# EasyEDA Pro project 2025_08_20_fpga.epro

# Board PCB1
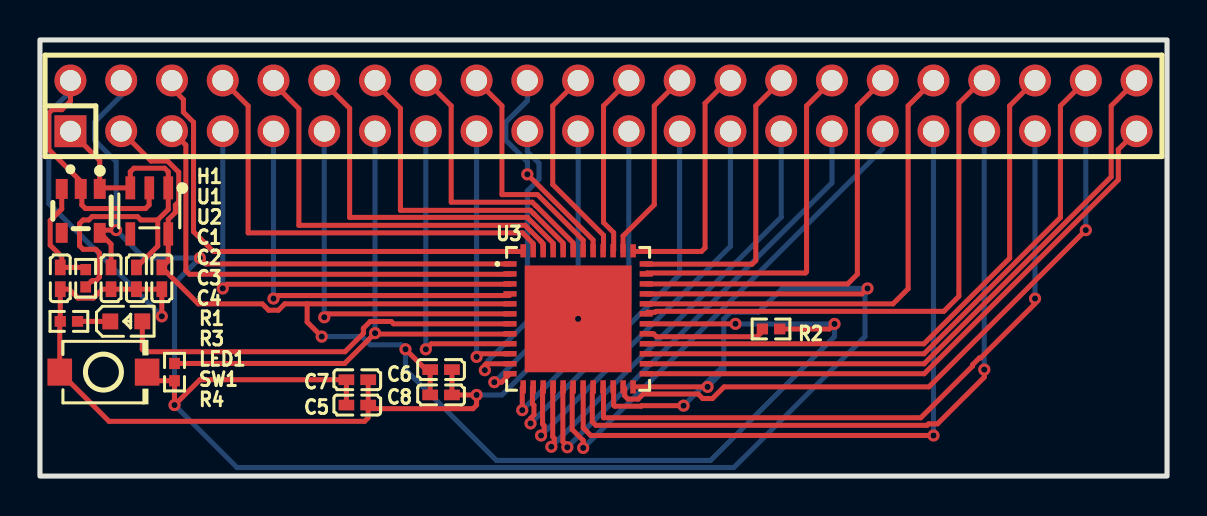
[diagram p0: board, top side]
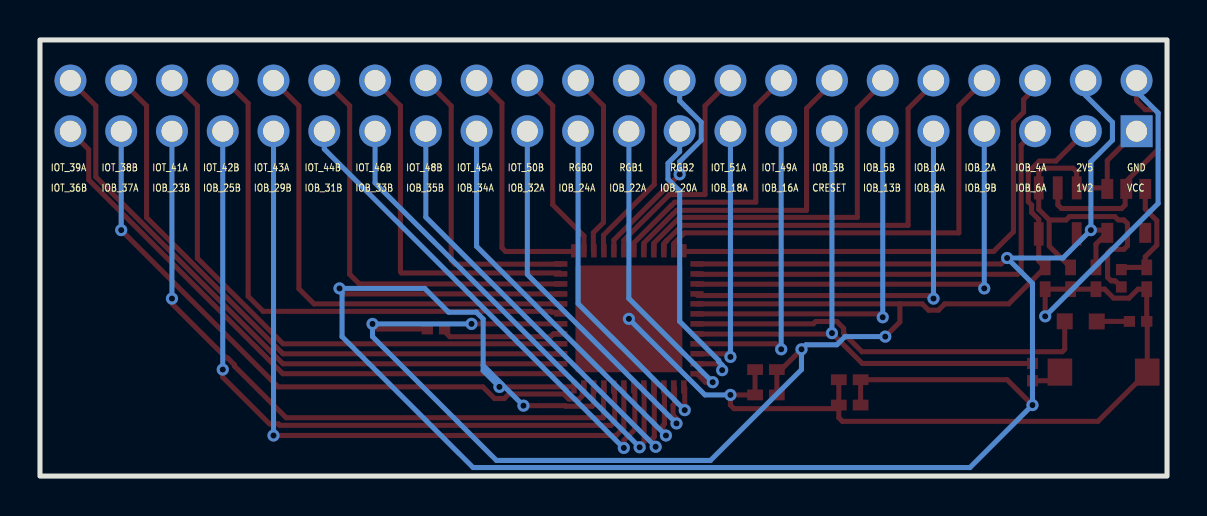
[diagram p1: board, bottom side, seen from below]

Outline 56.39 x 21.84 mm; copper layers: Top Layer, Bottom Layer. Coordinates in mm from the lower left corner of the outline.
Outline path: rectangle 0,21.84 56.39,0
Stack: Top Layer 0.035mm / Dielectric1 1.51mm FR4 er 4.5 / Bottom Layer 0.035mm

## Design rules (mm)
template: JLCPCB Capability(Two Layers Board)
spacing copperThickness1oz (default): track to track 0.102, other pairs 0.152 to 0.3
spacing copperThickness2oz: track to track 0.203, other pairs 0.152 to 0.3
track width copperThickness1oz (default): min 0.127, default 0.254, max 2.54
track width copperThickness2oz: min 0.203, default 0.254, max 2.54
differential pair differentialPair (default): width min 0.127, default 0.254, max 2.54; gap min 0.152, default 0.152
via viaSize (default): diameter min 0.5, default 0.61, max 10; hole min 0.3, default 0.305, max 6.3

## Placement (name value [footprint] x y rotation side)
C1  10uF  [C0402]  4.83 9.91 90 top
C2  1uF  [C0402]  1.02 9.91 90 top
C3  10uF  [C0402]  3.56 9.91 90 top
C4  10uF  [C0402]  6.1 9.91 90 top
C5  10uF  [C0402]  15.88 3.56 180 top
C6  10uF  [C0402]  20.07 5.33 180 top
C7  100nF  [C0402]  15.88 4.83 180 top
C8  100nF  [C0402]  20.07 4.06 180 top
H1  X6521WV-2x22H-C60D30  [HDR-TH_44P-2.54-V-M-R2-C22-S2.54]  28.19 18.54 0 top
LED1  XL-1608UBC-04  [LED0603-RD_BLUE]  4.32 7.75 0 top
R1  10kΩ  [R0402]  2.29 9.91 270 top
R2  100Ω  [R0402]  36.58 7.37 180 top
R3  100Ω  [R0402]  1.45 7.75 0 top
R4  10kΩ  [R0402]  6.73 5.21 90 top
SW1  TS-1088-AR02016  [SW-SMD_L3.9-W3.0-P4.45]  3.17 5.21 0 top
U1  TLV70225DBVR  [SOT-23-5_L2.9-W1.6-P0.95-LS2.8-BR]  2.04 13.28 90 top
U2  TLV70212DBVR  [SOT-23-5_L3.0-W1.7-P0.95-LS2.8-BL]  5.47 13.28 180 top
U3  ICE40UP5K-SG48I  [QFN-48_L7.0-W7.0-P0.50-TL-EP5.4-1]  26.92 7.87 0 top

## Footprints (pads in the part's own frame, mm; a bottom-side part is the same pattern mirrored in y, then rotated)
C0402
  rect 0.79x0.54 smd: 1(-0.545,0) 2(0.545,0)
HDR-TH_44P-2.54-V-M-R2-C22-S2.54
  rect 1.6x1.6 hole 1.05: 1(-26.67,-1.27)
  round 1.6 hole 1.05: 2(-26.67,1.27) 3(-24.13,-1.27) 4(-24.13,1.27) 5(-21.59,-1.27) 6(-21.59,1.27) 7(-19.05,-1.27) 8(-19.05,1.27) 9(-16.51,-1.27) 10(-16.51,1.27) 11(-13.97,-1.27) 12(-13.97,1.27) 13(-11.43,-1.27) 14(-11.43,1.27) 15(-8.89,-1.27) 16(-8.89,1.27) 17(-6.35,-1.27) 18(-6.35,1.27) 19(-3.81,-1.27) 20(-3.81,1.27) 21(-1.27,-1.27) 22(-1.27,1.27) 23(1.27,-1.27) 24(1.27,1.27) 25(3.81,-1.27) 26(3.81,1.27) 27(6.35,-1.27) 28(6.35,1.27) 29(8.89,-1.27) 30(8.89,1.27) 31(11.43,-1.27) 32(11.43,1.27) 33(13.97,-1.27) 34(13.97,1.27) 35(16.51,-1.27) 36(16.51,1.27) 37(19.05,-1.27) 38(19.05,1.27) 39(21.59,-1.27) 40(21.59,1.27) 41(24.13,-1.27) 42(24.13,1.27) 43(26.67,-1.27) 44(26.67,1.27)
LED0603-RD_BLUE
  rect 0.8x0.8 smd: 1(-0.799,-0.004) 2(0.799,0.004)
QFN-48_L7.0-W7.0-P0.50-TL-EP5.4-1
  rect 0.665x0.28 smd: 1(-3.408,2.75) 2(-3.408,2.25) 3(-3.408,1.75) 4(-3.408,1.25) 5(-3.408,0.75) 6(-3.408,0.25) 7(-3.408,-0.25) 8(-3.408,-0.75) 9(-3.408,-1.25) 10(-3.408,-1.75) 11(-3.408,-2.25) 12(-3.408,-2.75) 25(3.408,-2.75) 26(3.408,-2.25) 27(3.408,-1.75) 28(3.408,-1.25) 29(3.408,-0.75) 30(3.408,-0.25) 31(3.408,0.25) 32(3.408,0.75) 33(3.408,1.25) 34(3.408,1.75) 35(3.408,2.25) 36(3.408,2.75)
  rect 0.28x0.665 smd: 13(-2.75,-3.408) 14(-2.25,-3.408) 15(-1.75,-3.408) 16(-1.25,-3.408) 17(-0.75,-3.408) 18(-0.25,-3.408) 19(0.25,-3.408) 20(0.75,-3.408) 21(1.25,-3.408) 22(1.75,-3.408) 23(2.25,-3.408) 24(2.75,-3.408) 37(2.75,3.408) 38(2.25,3.408) 39(1.75,3.408) 40(1.25,3.408) 41(0.75,3.408) 42(0.25,3.408) 43(-0.25,3.408) 44(-0.75,3.408) 45(-1.25,3.408) 46(-1.75,3.408) 47(-2.25,3.408) 48(-2.75,3.408)
  rect 5.35x5.35 smd: 49(0,0)
R0402
  rect 0.566x0.54 smd: 1(-0.433,0) 2(0.433,0)
SOT-23-5_L2.9-W1.6-P0.95-LS2.8-BR
  rect 1x0.6 smd: 1(1.1,-0.95) 2(1.1,0) 3(1.1,0.95) 4(-1.1,0.95) 5(-1.1,-0.95)
SOT-23-5_L3.0-W1.7-P0.95-LS2.8-BL
  rect 0.49x1.157 smd: 1(-0.95,-1.153) 2(0,-1.153) 3(0.95,-1.153)
  rect 0.49x1.175 smd: 4(0.95,1.153) 5(-0.95,1.153)
SW-SMD_L3.9-W3.0-P4.45
  rect 1.23x1.36 smd: 1(-2.185,0) 2(2.185,0)

## Nets
1V2: C4.2 C6.2 C8.2 H1.3 R2.1 U2.5 U3.5 U3.30
2V5: C3.2 C5.2 C7.2 H1.4 R4.1 SW1.2 U1.5 U3.1 U3.22 U3.24 U3.33
GND: C1.1 C2.1 C3.1 C4.1 C5.1 C6.1 C7.1 C8.1 H1.2 R3.1 SW1.1 U1.2 U2.2 U3.49
VCC: C1.2 H1.1 R1.2 U1.1 U2.1 U2.3
VCCPLL: R2.2 U3.29
CDONE: LED1.2 U3.7
CRESET: H1.13 R4.2 U3.8
IOB_0A: H1.10 U3.46
IOB_2A: H1.8 U3.47
IOB_3B: H1.14 U3.44
IOB_4A: H1.6 U3.48
IOB_5B: H1.12 U3.45
IOB_6A: H1.5 U3.2
IOB_8A: H1.9 U3.4
IOB_9B: H1.7 U3.3
IOB_13B: H1.11 U3.6
IOB_16A: H1.15 U3.9
IOB_18A: H1.17 U3.10
IOB_20A: H1.19 U3.11
IOB_22A: H1.21 U3.12
IOB_23B: H1.39 U3.21
IOB_24A: H1.23 U3.13
IOB_25B: H1.37 U3.20
IOB_29B: H1.35 U3.19
IOB_31B: H1.33 U3.18
IOB_32A: H1.25 U3.14
IOB_33B: H1.31 U3.17
IOB_34A: H1.27 U3.15
IOB_35B: H1.29 U3.16
IOB_37A: H1.41 U3.23
IOT_36B: H1.43 U3.25
IOT_38B: H1.42 U3.27
IOT_39A: H1.44 U3.26
IOT_41A: H1.40 U3.28
IOT_42B: H1.38 U3.31
IOT_43A: H1.36 U3.32
IOT_44B: H1.34 U3.34
IOT_45A: H1.28 U3.37
IOT_46B: H1.32 U3.35
IOT_48B: H1.30 U3.36
IOT_49A: H1.16 U3.43
IOT_50B: H1.26 U3.38
IOT_51A: H1.18 U3.42
RGB0: H1.24 U3.39
RGB1: H1.22 U3.40
RGB2: H1.20 U3.41
$1N2833: C2.2 R1.1 U1.3
$1N2896: LED1.1 R3.2

Pads without a net: U1 4; U2 4

## Via types
v1: diameter 0.61, hole 0.305, Top Layer to Bottom Layer, 32 vias

## Routing (per net, layer and track width the routed paths; a pad name or vN(x,y) marks a point on that pad's centre or on a via; arc(x,y) is an arc through that point)
1V2: length 76.4
  Top Layer w0.254: U3.30 v1(34.8,7.62) ; H1.3 5.56,15.78 6.39,15.78 6.94,15.22 6.94,13.74 6.77,13.57 6.77,13.21 6.42,12.85 U2.5 6.42,10.77 C4.2 7.92,8.62 11.12,8.62 11.44,8.31 11.93,8.31 12.24,8.62 13.37,8.62 ; 13.37,8.62 13.37,7.72 v1(14.1,6.98) ; 13.37,8.62 U3.5 ; v1(18.29,6.35) 19.3,5.33 19.52,5.33 19.52,4.06 ; R2.1 39.5,7.37 v1(39.75,7.62)
  Bottom Layer w0.254: v1(14.1,6.98) 16.11,6.98 16.52,6.58 18.06,6.58 v1(18.29,6.35) 18.29,5.33 22.84,0.78 33.55,0.78 39.75,6.98 v1(39.75,7.62) 34.8,7.62 v1(34.8,7.62)
2V5: length 127.6
  Top Layer w0.254: U3.33 41.13,9.12 v1(41.4,9.4) ; C3.2 3.56,11.61 U1.5 3.13,12.32 v1(3.81,12.32) ; v1(8,10.92) 8.3,10.62 U3.1 ; U3.22 28.7,4.44 28.7,3.56 28.76,3.5 30.08,3.5 30.1,3.53 v1(32.2,3.53) ; v1(33.4,4.47) U3.24 ; SW1.2 5.79,4.77 R4.1 v1(6.73,3.56) 8,4.83 C7.2 C5.2
  Bottom Layer w0.254: v1(32.2,3.53) 34.21,5.54 ; 34.21,5.54 34.21,7.87 34.56,8.21 35.95,8.21 37.14,9.4 v1(41.4,9.4) 41.4,9.27 41.28,9.14 41.28,6.98 34.72,0.43 9.86,0.43 v1(6.73,3.56) 6.73,9.65 v1(8,10.92) 5.21,10.92 v1(3.81,12.32) 3.81,15.75 2.73,16.83 2.73,17.72 4.06,19.05 H1.4 ; 34.21,5.54 34.21,5.28 v1(33.4,4.47)
GND: length 71.3
  Top Layer w0.254: 5.47,14.44 5.46,14.43 5.46,13.58 5.28,13.4 2.28,13.4 2.1,13.58 2.1,14.33 U1.2 2.04,14.76 0.44,16.36 0.44,18.19 0.61,18.35 1.09,18.35 1.52,18.78 H1.2 ; C5.1 16.6,3.38 21.66,3.38 21.84,3.56 v1(21.84,4.06) C8.1 C6.1 ; C5.1 16.42,2.92 16.24,2.74 3.46,2.74 SW1.1 0.99,7.72 1.02,7.75 C2.1 1.45,9.36 1.9,8.91 2.67,8.91 3.12,9.36 C3.1 C1.1 C4.1 v1(6.1,8) ; C5.1 C7.1
  Bottom Layer w0.254: v1(26.92,7.87) 23.11,4.06 v1(21.84,4.06) ; v1(6.1,8) 0.44,13.65 0.44,18.19 1.52,19.27 H1.2
VCC: length 21.8
  Top Layer w0.254: R1.2 2.59,9.78 2.67,9.78 2.67,9.78 2.79,9.78 2.97,9.96 2.97,11.18 2.79,11.36 2.16,11.36 1.98,11.53 1.98,12.65 2.16,12.83 2.44,12.83 2.61,12.99 4.88,12.99 5.05,12.83 5.89,12.83 5.89,12.83 ; 5.89,12.83 5.89,11.52 C1.2 ; 5.89,12.83 6.42,13.36 6.42,15.24 6.24,15.42 4.7,15.42 4.52,15.24 4.52,14.44 ; 4.52,14.44 3.04,14.44 2.99,14.38 2.99,15.81 H1.1
VCCPLL: length 6.1
  Top Layer w0.254: U3.29 30.7,7.12 30.84,6.98 35.88,6.98 36.14,7.24 R2.2
CDONE: length 20.7
  Top Layer w0.254: U3.7 17.69,7.62 17.57,7.74 16.52,7.74 16.18,7.4 16.18,7.15 15.26,6.23 5.24,6.23 5.12,6.35 LED1.2
CRESET: length 27.6
  Top Layer w0.254: U3.8 23.5,7.11 16.81,7.11 v1(16.76,7.16) 15.25,5.64 R4.2
  Bottom Layer w0.254: H1.13 v1(16.76,7.16)
IOB_0A: length 20.7
  Top Layer w0.254: U3.46 25.17,11.64 25.09,11.72 25.09,11.73 25.03,11.79 25.03,11.8 24.27,12.56 12.95,12.56 12.95,18.4 11.68,19.67 H1.10
IOB_2A: length 23
  Top Layer w0.254: H1.8 10.41,18.54 10.41,12.18 24.14,12.18 24.67,11.65 U3.47
IOB_3B: length 16.2
  Top Layer w0.254: H1.14 16.76,19.69 18.03,18.41 18.03,13.31 24.53,13.31 24.71,13.13 24.72,13.13 26.17,11.67 U3.44
IOB_4A: length 24.9
  Top Layer w0.254: H1.6 6.6,19.43 7.17,18.86 7.17,18.23 7.68,17.72 7.68,12.24 8.67,11.25 24.14,11.25 U3.48
IOB_5B: length 18.5
  Top Layer w0.254: U3.45 25.67,11.66 24.38,12.95 15.49,12.95 15.49,18.41 14.22,19.69 H1.12
IOB_6A: length 23.6
  Top Layer w0.254: U3.2 23.5,10.11 7.48,10.11 7.3,10.29 7.3,16.58 H1.5
IOB_8A: length 20.3
  Top Layer w0.254: v1(11.68,8.89) 11.84,9.04 23.5,9.04
  Bottom Layer w0.254: H1.9 v1(11.68,8.89)
IOB_9B: length 22.3
  Top Layer w0.254: U3.3 23.5,9.61 9.36,9.61 v1(9.14,9.4)
  Bottom Layer w0.254: H1.7 v1(9.14,9.4)
IOB_13B: length 18.7
  Top Layer w0.254: v1(14.22,7.95) 14.39,8.12 U3.6
  Bottom Layer w0.254: H1.11 v1(14.22,7.95)
IOB_16A: length 15.2
  Top Layer w0.254: U3.9 19.58,6.62 v1(19.3,6.35)
  Bottom Layer w0.254: H1.15 v1(19.3,6.35)
IOB_18A: length 13
  Top Layer w0.254: v1(21.84,5.97) 22,6.12 U3.10
  Bottom Layer w0.254: H1.17 v1(21.84,5.97)
IOB_20A: length 14.9
  Top Layer w0.254: U3.11 22.32,5.62 22.26,5.56 v1(22.26,5.3)
  Bottom Layer w0.254: H1.19 24.38,16.25 24.97,15.67 24.97,14.87 24.38,14.29 24.38,7.75 22.43,5.79 22.43,5.73 22.26,5.56 v1(22.26,5.3)
IOB_22A: length 15.3
  Top Layer w0.254: v1(22.73,4.7) 23.09,4.7 U3.12
  Bottom Layer w0.254: H1.21 26.92,8.89 v1(22.73,4.7)
IOB_23B: length 34.2
  Top Layer w0.254: U3.21 28.17,4.21 28.19,4.19 28.19,2.92 44.07,2.92 46.66,5.51 46.66,5.58 47,5.92 47.07,5.92 49.78,8.64 v1(49.78,8.89)
  Bottom Layer w0.254: H1.39 v1(49.78,8.89)
IOB_24A: length 17.4
  Top Layer w0.254: U3.13 24.13,4.42 v1(24.13,3.3)
  Bottom Layer w0.254: H1.23 29.46,8.64 v1(24.13,3.3)
IOB_25B: length 34.8
  Top Layer w0.254: U3.20 27.67,4.21 27.63,4.17 27.63,2.72 27.81,2.54 44.39,2.54 44.46,2.62 44.91,2.62 47.24,4.95 v1(47.24,5.33)
  Bottom Layer w0.254: H1.37 v1(47.24,5.33)
IOB_29B: length 35
  Top Layer w0.254: v1(44.7,2.03) 27.56,2.03 27.18,2.41 27.18,4.46 U3.19
  Bottom Layer w0.254: H1.35 v1(44.7,2.03)
IOB_31B: length 25.4
  Top Layer w0.254: v1(27.18,1.41) 27.18,1.78 26.63,2.33 26.63,4.42 U3.18
  Bottom Layer w0.254: v1(27.18,1.41) 27.19,1.41 42.16,16.38 H1.33
IOB_32A: length 19.7
  Top Layer w0.254: U3.14 24.64,4.43 24.64,3.62 24.71,3.54 24.71,3.06 24.54,2.89 v1(24.54,2.64)
  Bottom Layer w0.254: v1(24.54,2.64) 32,10.1 H1.25
IOB_33B: length 24.4
  Top Layer w0.254: U3.17 26.16,4.45 26.16,1.72 26.39,1.49 v1(26.39,1.44)
  Bottom Layer w0.254: v1(26.39,1.44) 39.62,14.68 H1.31
IOB_34A: length 21.8
  Top Layer w0.254: v1(25.07,2.03) 25.21,2.03 25.22,2.04 25.22,2.53 25.15,2.6 25.15,4.44 U3.15
  Bottom Layer w0.254: H1.27 34.54,11.51 v1(25.07,2.03)
IOB_35B: length 23.8
  Top Layer w0.254: v1(25.58,1.47) 25.67,1.47 25.73,1.41 25.73,1.89 25.65,1.97 25.65,4.45 U3.16
  Bottom Layer w0.254: H1.29 37.08,12.97 v1(25.58,1.47)
IOB_37A: length 32.3
  Top Layer w0.254: U3.23 29.25,4.39 29.25,4.02 29.42,3.86 29.93,3.86 30.19,4.11 32.93,4.11 33.16,3.88 33.64,3.88 34.23,4.47 44.47,4.47 v1(52.32,12.32)
  Bottom Layer w0.254: H1.41 v1(52.32,12.32)
IOT_36B: length 30.5
  Top Layer w0.254: U3.25 44.24,5.12 53.95,14.84 53.95,16.36 H1.43
IOT_38B: length 30.9
  Top Layer w0.254: H1.42 51.05,18.54 51.05,12.95 44.23,6.12 U3.27
IOT_39A: length 32.5
  Top Layer w0.254: U3.26 44.23,5.62 53.59,14.99 53.59,18.54 H1.44
IOT_41A: length 29.4
  Top Layer w0.254: U3.28 44.22,6.62 48.51,10.91 48.51,18.54 H1.40
IOT_42B: length 27.4
  Top Layer w0.254: H1.38 47.12,19.81 45.97,18.67 45.97,9 45.22,8.25 30.83,8.25 30.78,8.2 30.41,8.2 U3.31
IOT_43A: length 24.4
  Top Layer w0.254: H1.36 43.43,18.54 43.43,9.38 42.68,8.62 U3.32
IOT_44B: length 21
  Top Layer w0.254: U3.34 40.41,9.62 40.89,10.11 40.89,18.54 H1.34
IOT_45A: length 12.7
  Top Layer w0.254: H1.28 34.42,19.81 33.27,18.67 33.27,11.43 33.09,11.25 29.71,11.25 U3.37
IOT_46B: length 18.2
  Top Layer w0.254: U3.35 30.38,10.17 38.29,10.17 38.35,10.23 38.35,18.54 H1.32
IOT_48B: length 15.1
  Top Layer w0.254: U3.36 30.34,10.62 35.63,10.62 35.81,10.8 35.81,18.54 H1.30
IOT_49A: length 14
  Top Layer w0.254: H1.16 20.57,18.54 20.57,13.72 24.63,13.72 24.81,13.54 24.82,13.54 26.67,11.68 U3.43
IOT_50B: length 9.7
  Top Layer w0.254: U3.38 29.17,12.03 30.73,13.59 30.73,18.54 H1.26
IOT_51A: length 11.8
  Top Layer w0.254: U3.42 27.18,11.29 27.18,11.81 24.89,14.1 23.11,14.1 23.11,18.54 H1.18
RGB0: length 9.3
  Top Layer w0.254: H1.24 28.19,18.54 28.19,12.7 28.7,12.19 28.7,11.31 U3.39
RGB1: length 10.1
  Top Layer w0.254: U3.40 28.19,11.3 28.19,12.06 25.65,14.61 25.65,18.54 H1.22
RGB2: length 10.8
  Top Layer w0.254: v1(24.38,15.11) 27.67,11.82 U3.41
  Bottom Layer w0.254: H1.20 24.38,18.8 23.31,17.72 23.31,16.83 24.38,15.75 v1(24.38,15.11)
$1N2833: length 5.8
  Top Layer w0.254: U1.3 1.09,13.38 0.51,12.8 0.51,11.57 1.09,10.99 1.09,10.52 C2.2 2.17,10.45 R1.1
$1N2896: length 1.6
  Top Layer w0.254: LED1.1 3.52,7.75 R3.2

## Text on the board
Bottom Silkscreen Layer: GND | VCC | 2V5 | 1V2 | IOB_4A | IOB_6A | IOB_2A | IOB_9B | IOB_0A | IOB_8A | IOB_5B | IOB_13B | IOB_3B | CRESET | IOT_49A | IOB_16A | IOT_51A | IOB_18A | RGB2 | IOB_20A | RGB1 | IOB_22A | RGB0 | IOB_24A | IOT_50B | IOB_32A | IOT_45A | IOB_34A | IOT_48B | IOB_35B | IOT_46B | IOB_33B | IOT_44B | IOB_31B | IOT_43A | IOB_29B | IOT_42B | IOB_25B | IOT_41A | IOB_23B | IOT_38B | IOB_37A | IOT_39A | IOT_36B
